# Altium schematic sheet power_budget.SchDoc: Power budget and battery selection
size A4; SheetNumber: 20; SheetTotal: 20; TitleBig: Power budget and battery selection; Desc_line1: Detailed estimation of typical and worst-case power consumption per component in order to define battery; Desc_line2: requirements. Choosing an adequate battery.
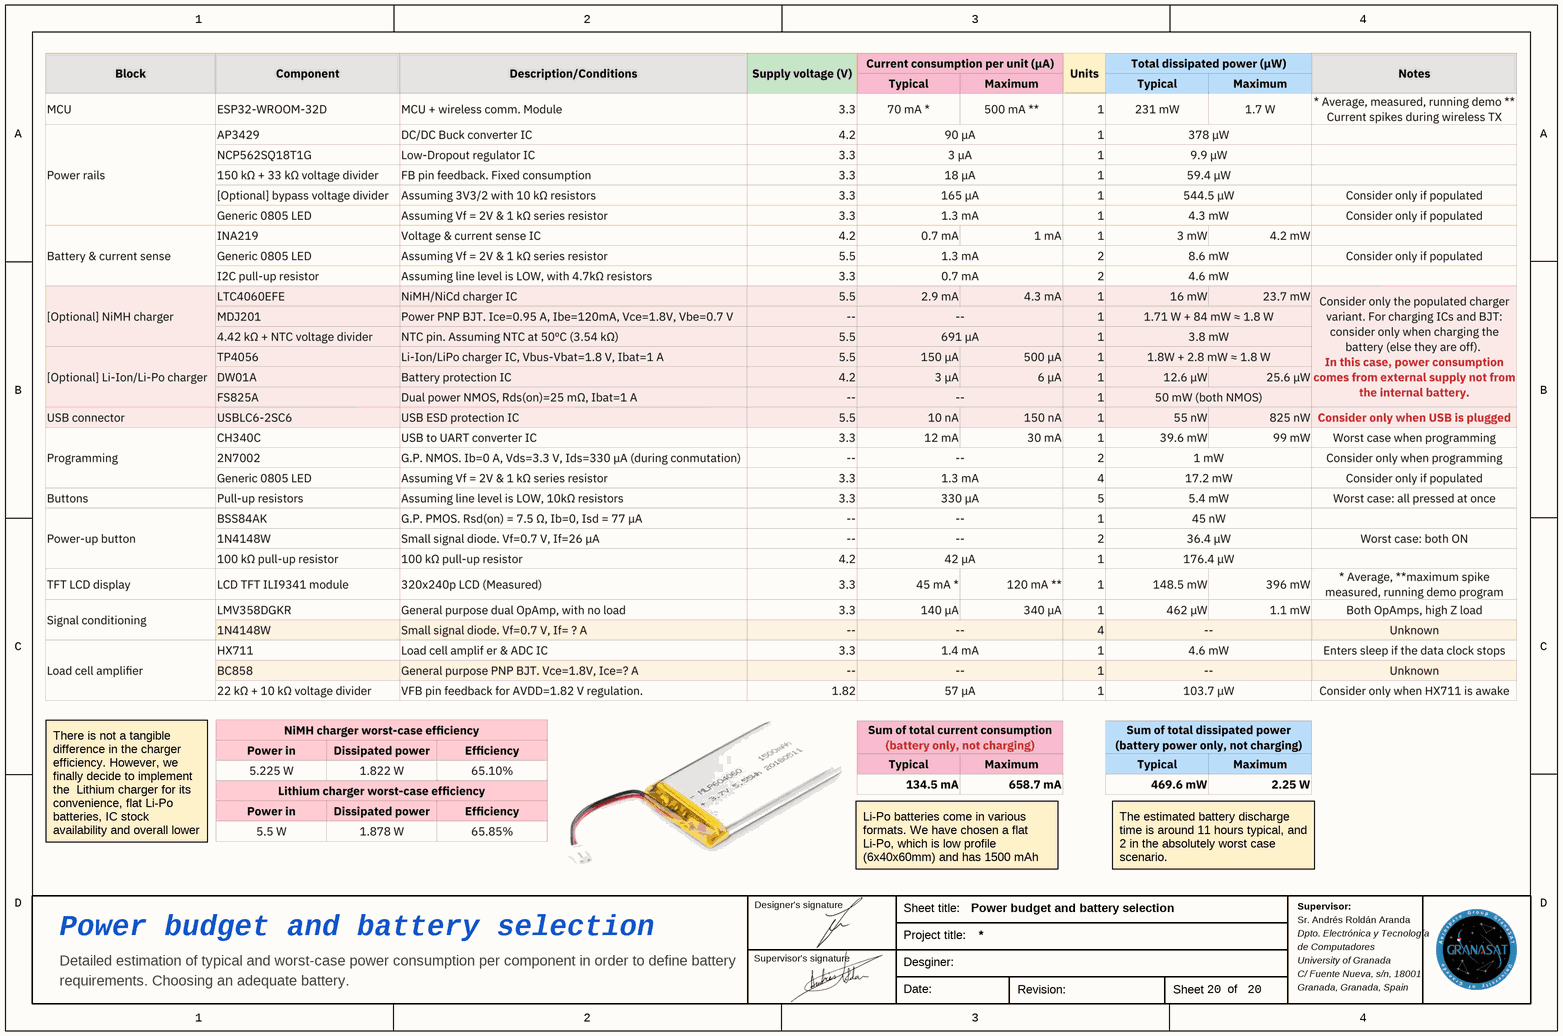
[diagram p0: power_budget.SchDoc]

## Notes on the sheet
- There is not a tangible difference in the charger efficiency. However, we finally decide to implement the  Lithium charger for its convenience, flat Li-Po batteries, IC stock availability and overall lower price.
- Li-Po batteries come in various formats. We have chosen a flat Li-Po, which is low profile (6x40x60mm) and has 1500 mAh (approx 5.5 Wh) of energy.
- The estimated battery discharge time is around 11 hours typical, and 2 in the absolutely worst case scenario.
- Designer's signature
- Sheet title:
- Sr. Andrés Roldán Aranda
- Supervisor:
- Supervisor's signature
- Project title:
- Desginer:
- Dpto. Electrónica y Tecnología
- de Computadores
- University of Granada
- C/ Fuente Nueva, s/n, 18001
- Granada, Granada, Spain
- Date:
- Revision:
- Sheet
- of